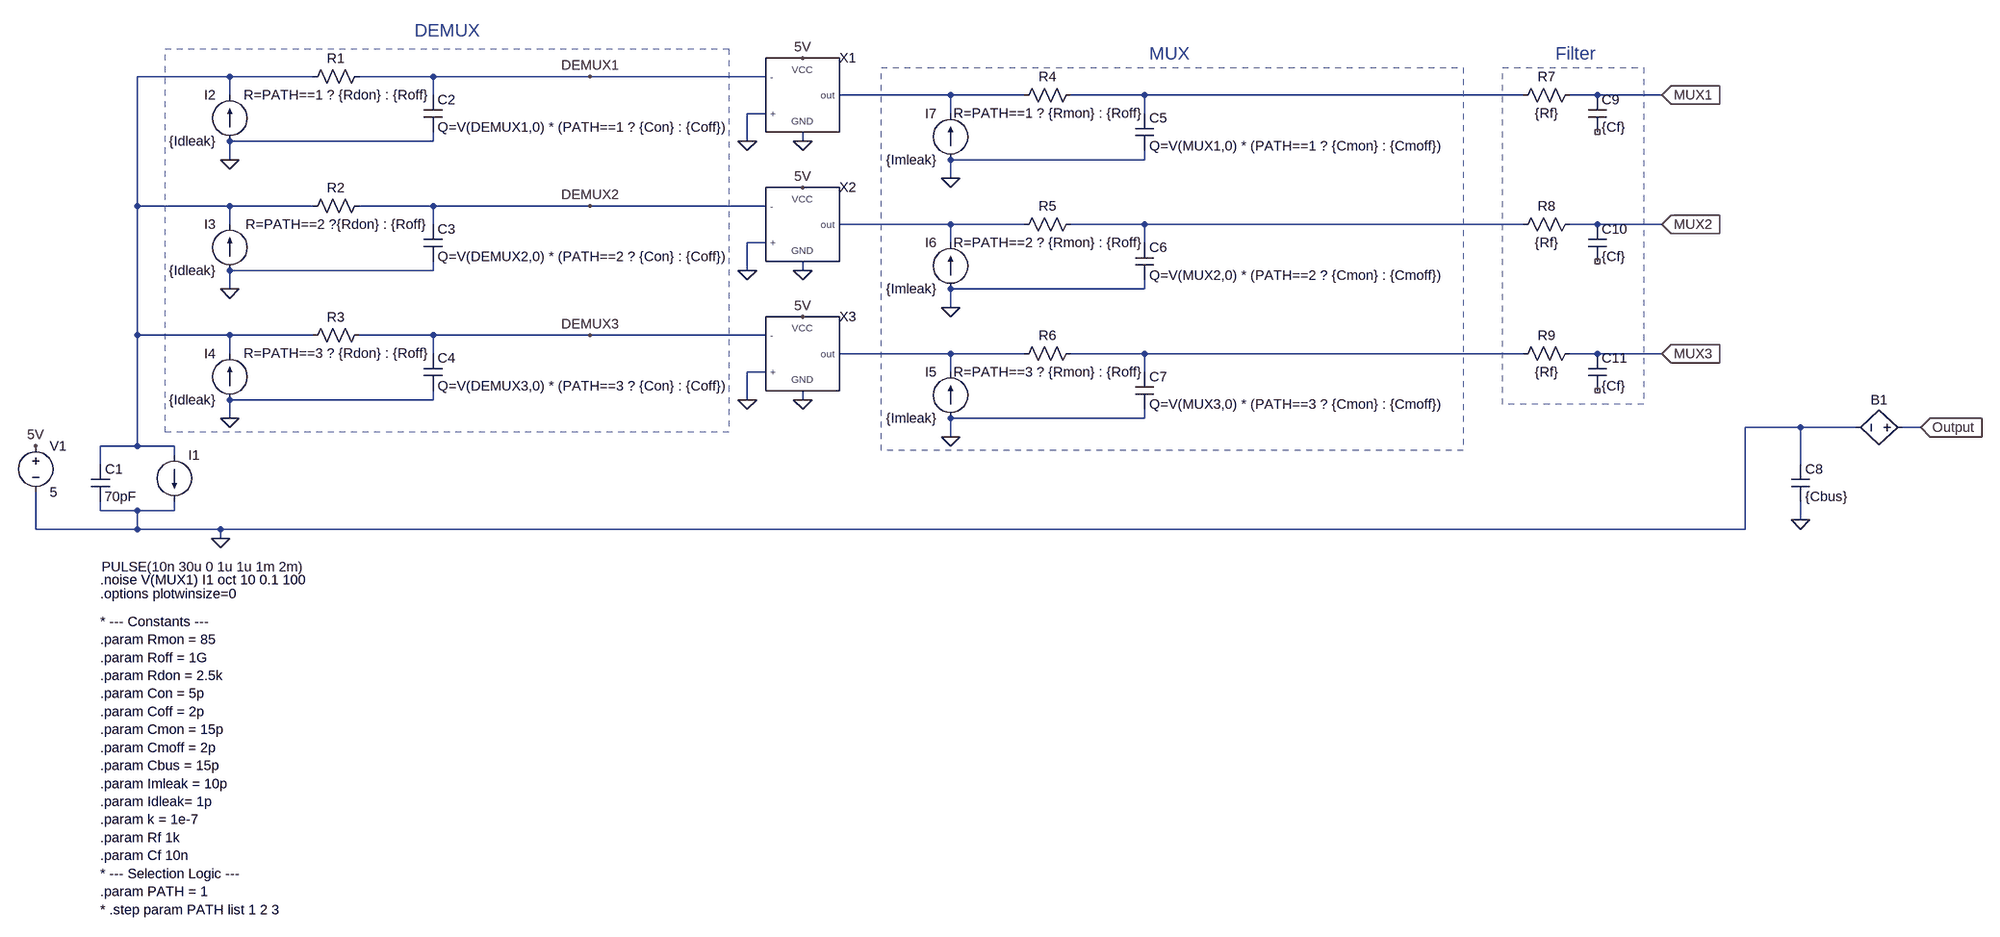
[diagram p0: schematic opm-simulation.asc]
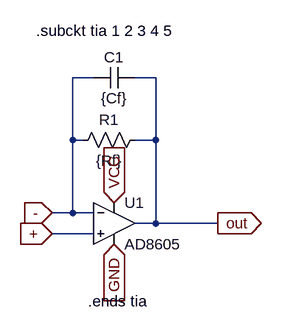
[diagram p1: sub-circuit tia.asc]
opm-simulation.asc, the LTspice schematic file:
Version 4
SHEET 1 4096 1108
WIRE 384 -400 224 -400
WIRE 528 -400 384 -400
WIRE 736 -400 608 -400
WIRE 1008 -400 736 -400
WIRE 1312 -400 1008 -400
WIRE 384 -368 384 -400
WIRE 736 -368 736 -400
WIRE 1632 -368 1440 -368
WIRE 1760 -368 1632 -368
WIRE 1968 -368 1840 -368
WIRE 2624 -368 1968 -368
WIRE 2752 -368 2704 -368
WIRE 2864 -368 2752 -368
WIRE 1312 -336 1280 -336
WIRE 1632 -336 1632 -368
WIRE 1968 -336 1968 -368
WIRE 736 -288 736 -304
WIRE 736 -288 384 -288
WIRE 1280 -288 1280 -336
WIRE 1376 -288 1376 -304
WIRE 384 -256 384 -288
WIRE 1968 -256 1968 -272
WIRE 1968 -256 1632 -256
WIRE 1632 -224 1632 -256
WIRE 224 -176 224 -400
WIRE 384 -176 224 -176
WIRE 528 -176 384 -176
WIRE 736 -176 608 -176
WIRE 1008 -176 736 -176
WIRE 1312 -176 1008 -176
WIRE 384 -144 384 -176
WIRE 736 -144 736 -176
WIRE 1632 -144 1440 -144
WIRE 1760 -144 1632 -144
WIRE 1968 -144 1840 -144
WIRE 2624 -144 1968 -144
WIRE 2752 -144 2704 -144
WIRE 2864 -144 2752 -144
WIRE 1312 -112 1280 -112
WIRE 1632 -112 1632 -144
WIRE 1968 -112 1968 -144
WIRE 736 -64 736 -80
WIRE 736 -64 384 -64
WIRE 1280 -64 1280 -112
WIRE 1376 -64 1376 -80
WIRE 384 -32 384 -64
WIRE 1968 -32 1968 -48
WIRE 1968 -32 1632 -32
WIRE 1632 0 1632 -32
WIRE 224 48 224 -176
WIRE 384 48 224 48
WIRE 528 48 384 48
WIRE 736 48 608 48
WIRE 1008 48 736 48
WIRE 1312 48 1008 48
WIRE 384 80 384 48
WIRE 736 80 736 48
WIRE 1632 80 1440 80
WIRE 1760 80 1632 80
WIRE 1968 80 1840 80
WIRE 2624 80 1968 80
WIRE 2752 80 2704 80
WIRE 2864 80 2752 80
WIRE 1312 112 1280 112
WIRE 1632 112 1632 80
WIRE 1968 112 1968 80
WIRE 736 160 736 144
WIRE 736 160 384 160
WIRE 1280 160 1280 112
WIRE 1376 160 1376 144
WIRE 384 192 384 160
WIRE 1968 192 1968 176
WIRE 1968 192 1632 192
WIRE 3104 208 3008 208
WIRE 3200 208 3104 208
WIRE 3312 208 3280 208
WIRE 1632 224 1632 192
WIRE 224 240 224 48
WIRE 224 240 160 240
WIRE 288 240 224 240
WIRE 288 256 288 240
WIRE 160 272 160 240
WIRE 3104 272 3104 208
WIRE 160 352 160 336
WIRE 224 352 160 352
WIRE 288 352 288 336
WIRE 288 352 224 352
WIRE 3104 368 3104 336
WIRE 48 384 48 320
WIRE 224 384 224 352
WIRE 224 384 48 384
WIRE 368 384 224 384
WIRE 3008 384 3008 208
WIRE 3008 384 368 384
WIRE 368 400 368 384
FLAG 368 400 0
FLAG 3312 208 Output
IOPIN 3312 208 In
FLAG 48 240 5V
FLAG 1376 16 5V
FLAG 1376 -208 5V
FLAG 1376 -432 5V
FLAG 1376 160 0
FLAG 1376 -64 0
FLAG 1376 -288 0
FLAG 1280 -288 0
FLAG 1280 -64 0
FLAG 1280 160 0
FLAG 384 192 0
FLAG 384 -32 0
FLAG 384 -256 0
FLAG 1632 224 0
FLAG 1632 0 0
FLAG 1632 -224 0
FLAG 3104 368 0
FLAG 1008 -400 DEMUX1
FLAG 1008 -176 DEMUX2
FLAG 1008 48 DEMUX3
FLAG 2864 -368 MUX1
IOPIN 2864 -368 In
FLAG 2864 80 MUX3
IOPIN 2864 80 In
FLAG 2864 -144 MUX2
IOPIN 2864 -144 In
SYMBOL current 288 256 R0
WINDOW 3 -126 193 Left 2
WINDOW 39 0 0 Left 0
SYMATTR Value PULSE(10n 30u 0 1u 1u 1m 2m)
SYMATTR InstName I1
SYMBOL bv 3296 208 R90
WINDOW 3 32 56 Invisible 2
WINDOW 0 -32 56 VBottom 2
SYMATTR Value V = int(((PATH==1)*V(MUX1) + (PATH==2)*V(MUX2) + (PATH==3)*V(MUX3) + k*(V(MUX1)+V(MUX2)+V(MUX3)) ) * 16777215 / 5 + 0.5) * (5 / 16777215)
SYMATTR InstName B1
SYMBOL voltage 48 224 R0
SYMATTR InstName V1
SYMATTR Value 5
SYMBOL Cap 144 272 R0
WINDOW 3 79 56 Right 2
SYMATTR Value 70pF
SYMATTR InstName C1
SYMBOL tia 1376 -368 R0
SYMATTR InstName X1
SYMATTR SpiceLine Rf=10k Cf=56p
SYMBOL tia 1376 -144 R0
SYMATTR InstName X2
SYMATTR SpiceLine Rf=100k Cf=11p
SYMBOL tia 1376 80 R0
SYMATTR InstName X3
SYMATTR SpiceLine Rf=1Meg Cf=3.1pF
SYMBOL Res 624 -416 R90
WINDOW 0 0 56 VBottom 2
WINDOW 3 32 56 VTop 2
SYMATTR InstName R1
SYMATTR Value R=PATH==1 ? {Rdon} : {Roff}
SYMBOL Res 624 -192 R90
WINDOW 0 0 56 VBottom 2
WINDOW 3 32 56 VTop 2
SYMATTR InstName R2
SYMATTR Value R=PATH==2 ?{Rdon} : {Roff}
SYMBOL Res 624 32 R90
WINDOW 0 0 56 VBottom 2
WINDOW 3 32 56 VTop 2
SYMATTR InstName R3
SYMATTR Value R=PATH==3 ? {Rdon} : {Roff}
SYMBOL current 384 -288 R180
WINDOW 0 24 80 Left 2
WINDOW 3 24 0 Left 2
SYMATTR InstName I2
SYMATTR Value {Idleak}
SYMBOL current 384 -64 R180
WINDOW 0 24 80 Left 2
WINDOW 3 24 0 Left 2
SYMATTR InstName I3
SYMATTR Value {Idleak}
SYMBOL current 384 160 R180
WINDOW 0 24 80 Left 2
WINDOW 3 24 0 Left 2
SYMATTR InstName I4
SYMATTR Value {Idleak}
SYMBOL Cap 720 -368 R0
SYMATTR InstName C2
SYMATTR Value Q=V(DEMUX1,0) * (PATH==1 ? {Con} : {Coff})
SYMBOL Cap 720 -144 R0
SYMATTR InstName C3
SYMATTR Value Q=V(DEMUX2,0) * (PATH==2 ? {Con} : {Coff})
SYMBOL Cap 720 80 R0
SYMATTR InstName C4
SYMATTR Value Q=V(DEMUX3,0) * (PATH==3 ? {Con} : {Coff})
SYMBOL Res 1856 -384 R90
WINDOW 0 0 56 VBottom 2
WINDOW 3 32 56 VTop 2
SYMATTR InstName R4
SYMATTR Value R=PATH==1 ? {Rmon} : {Roff}
SYMBOL Res 1856 -160 R90
WINDOW 0 0 56 VBottom 2
WINDOW 3 32 56 VTop 2
SYMATTR InstName R5
SYMATTR Value R=PATH==2 ? {Rmon} : {Roff}
SYMBOL Res 1856 64 R90
WINDOW 0 0 56 VBottom 2
WINDOW 3 32 56 VTop 2
SYMATTR InstName R6
SYMATTR Value R=PATH==3 ? {Rmon} : {Roff}
SYMBOL Cap 1952 -336 R0
SYMATTR InstName C5
SYMATTR Value Q=V(MUX1,0) * (PATH==1 ? {Cmon} : {Cmoff})
SYMBOL Cap 1952 -112 R0
SYMATTR InstName C6
SYMATTR Value Q=V(MUX2,0) * (PATH==2 ? {Cmon} : {Cmoff})
SYMBOL Cap 1952 112 R0
SYMATTR InstName C7
SYMATTR Value Q=V(MUX3,0) * (PATH==3 ? {Cmon} : {Cmoff})
SYMBOL current 1632 192 R180
WINDOW 0 24 80 Left 2
WINDOW 3 24 0 Left 2
SYMATTR InstName I5
SYMATTR Value {Imleak}
SYMBOL current 1632 -32 R180
WINDOW 0 24 80 Left 2
WINDOW 3 24 0 Left 2
SYMATTR InstName I6
SYMATTR Value {Imleak}
SYMBOL current 1632 -256 R180
WINDOW 0 24 80 Left 2
WINDOW 3 24 0 Left 2
SYMATTR InstName I7
SYMATTR Value {Imleak}
SYMBOL Cap 3088 272 R0
SYMATTR InstName C8
SYMATTR Value {Cbus}
SYMBOL Res 2720 -384 R90
WINDOW 0 0 56 VBottom 2
WINDOW 3 32 56 VTop 2
SYMATTR InstName R7
SYMATTR Value {Rf}
SYMBOL Res 2720 -160 R90
WINDOW 0 0 56 VBottom 2
WINDOW 3 32 56 VTop 2
SYMATTR InstName R8
SYMATTR Value {Rf}
SYMBOL Res 2720 64 R90
WINDOW 0 0 56 VBottom 2
WINDOW 3 32 56 VTop 2
SYMATTR InstName R9
SYMATTR Value {Rf}
SYMBOL Cap 2736 -368 R0
SYMATTR InstName C9
SYMATTR Value {Cf}
SYMBOL Cap 2736 -144 R0
SYMATTR InstName C10
SYMATTR Value {Cf}
SYMBOL Cap 2736 80 R0
SYMATTR InstName C11
SYMATTR Value {Cf}
TEXT 160 472 Left 2 !.noise V(MUX1) I1 oct 10 0.1 100
TEXT 160 496 Left 2 !.options plotwinsize=0
TEXT 160 544 Left 2 !* --- Constants ---\n.param Rmon = 85\n.param Roff = 1G\n.param Rdon = 2.5k\n.param Con = 5p\n.param Coff = 2p\n.param Cmon = 15p\n.param Cmoff = 2p\n.param Cbus = 15p\n.param Imleak = 10p\n.param Idleak= 1p\n.param k = 1e-7\n.param Rf 1k\n.param Cf 10n\n* --- Selection Logic ---\n.param PATH = 1\n* .step param PATH list 1 2 3
TEXT 704 -480 Left 3 ;DEMUX
TEXT 1976 -440 Left 3 ;MUX
TEXT 2680 -440 Left 3 ;Filter
RECTANGLE Normal 272 -448 1248 216 2
RECTANGLE Normal 1512 -416 2520 248 2
RECTANGLE Normal 2588 -416 2832 168 2

tia.asc, the sub-circuit schematic file:
Version 4
SHEET 1 2352 680
WIRE 304 -160 272 -160
WIRE 400 -160 368 -160
WIRE 272 -64 272 -160
WIRE 288 -64 272 -64
WIRE 400 -64 400 -160
WIRE 400 -64 368 -64
WIRE 272 48 272 -64
WIRE 272 48 240 48
WIRE 304 48 272 48
WIRE 400 64 400 -64
WIRE 400 64 368 64
WIRE 496 64 400 64
WIRE 304 80 240 80
FLAG 240 48 -
IOPIN 240 48 In
FLAG 240 80 +
IOPIN 240 80 In
FLAG 496 64 out
IOPIN 496 64 Out
FLAG 336 96 GND
IOPIN 336 96 In
FLAG 336 32 VCC
IOPIN 336 32 In
SYMBOL OpAmps/AD8605 336 0 R0
SYMATTR InstName U1
SYMBOL Res 384 -80 R90
WINDOW 0 0 56 VBottom 2
WINDOW 3 32 56 VTop 2
SYMATTR InstName R1
SYMATTR Value {Rf}
SYMBOL Cap 368 -176 R90
WINDOW 0 0 32 VBottom 2
WINDOW 3 32 32 VTop 2
SYMATTR InstName C1
SYMATTR Value {Cf}
TEXT 216 -232 Left 2 !.subckt tia 1 2 3 4 5
TEXT 296 184 Left 2 !.ends tia

The netlist it stands for:
* opm-simulation.asc
I1 N001 0 PULSE(10n 30u 0 1u 1u 1m 2m)
B1 Output 0 V = int(((PATH==1)*V(MUX1) + (PATH==2)*V(MUX2) + (PATH==3)*V(MUX3) + k*(V(MUX1)+V(MUX2)+V(MUX3)) ) * 16777215 / 5 + 0.5) * (5 / 16777215)
V1 5V 0 5
C1 N001 0 70pF
XX1 0 DEMUX1 0 5V N002 tia params: Rf=10k Cf=56p
XX2 0 DEMUX2 0 5V N004 tia params: Rf=100k Cf=11p
XX3 0 DEMUX3 0 5V N006 tia params: Rf=1Meg Cf=3.1pF
R1 DEMUX1 N001 R=PATH==1 ? {Rdon} : {Roff}
R2 DEMUX2 N001 R=PATH==2 ?{Rdon} : {Roff}
R3 DEMUX3 N001 R=PATH==3 ? {Rdon} : {Roff}
I2 0 N001 {Idleak}
I3 0 N001 {Idleak}
I4 0 N001 {Idleak}
C2 DEMUX1 0 Q=V(DEMUX1,0) * (PATH==1 ? {Con} : {Coff})
C3 DEMUX2 0 Q=V(DEMUX2,0) * (PATH==2 ? {Con} : {Coff})
C4 DEMUX3 0 Q=V(DEMUX3,0) * (PATH==3 ? {Con} : {Coff})
R4 N003 N002 R=PATH==1 ? {Rmon} : {Roff}
R5 N005 N004 R=PATH==2 ? {Rmon} : {Roff}
R6 N007 N006 R=PATH==3 ? {Rmon} : {Roff}
C5 N003 0 Q=V(MUX1,0) * (PATH==1 ? {Cmon} : {Cmoff})
C6 N005 0 Q=V(MUX2,0) * (PATH==2 ? {Cmon} : {Cmoff})
C7 N007 0 Q=V(MUX3,0) * (PATH==3 ? {Cmon} : {Cmoff})
I5 0 N006 {Imleak}
I6 0 N004 {Imleak}
I7 0 N002 {Imleak}
C8 0 0 {Cbus}
R7 MUX1 N003 {Rf}
R8 MUX2 N005 {Rf}
R9 MUX3 N007 {Rf}
C9 MUX1 NC_01 {Cf}
C10 MUX2 NC_02 {Cf}
C11 MUX3 NC_03 {Cf}

* block symbol definitions
.subckt tia + - GND VCC out
XU1 + - VCC GND out AD8605  ; pins In+ In- V+ V- OUT
R1 out - {Rf}
C1 out - {Cf}
.subckt tia 1 2 3 4 5
.ends tia
.ends tia

.noise V(MUX1) I1 oct 10 0.1 100
.options plotwinsize=0
* --- Constants ---
.param Rmon = 85
.param Roff = 1G
.param Rdon = 2.5k
.param Con = 5p
.param Coff = 2p
.param Cmon = 15p
.param Cmoff = 2p
.param Cbus = 15p
.param Imleak = 10p
.param Idleak= 1p
.param k = 1e-7
.param Rf 1k
.param Cf 10n
* --- Selection Logic ---
.param PATH = 1
* .step param PATH list 1 2 3
* DEMUX
* MUX
* Filter
.lib ADI.lib
.backanno
.end